# Altium schematic sheet BANK_3.SchDoc
size A4
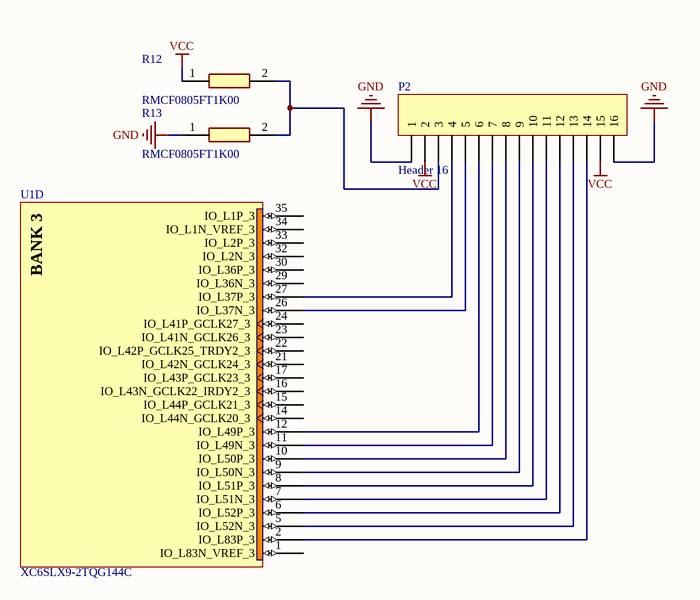
[diagram p0: BANK_3.SchDoc]

## Parts
P2  Header 16  [HDR1X16]
R12  RMCF0805FT1K00  [RESC2012X65N]
R13  RMCF0805FT1K00  [RESC2012X65N]
U1  XC6SLX9-2TQG144C  [TQG144_N]  (part D of 7)

## Nets
GND: P2.1 P2.16 R13.1
VCC: P2.2 P2.15 R12.1
NetP2_3: P2.3 R12.2 R13.2
NetP2_4: P2.4 U1.27(IO_L37P_3)
NetP2_5: P2.5 U1.26(IO_L37N_3)
NetP2_6: P2.6 U1.12(IO_L49P_3)
NetP2_7: P2.7 U1.11(IO_L49N_3)
NetP2_8: P2.8 U1.10(IO_L50P_3)
NetP2_9: P2.9 U1.9(IO_L50N_3)
NetP2_10: P2.10 U1.8(IO_L51P_3)
NetP2_11: P2.11 U1.7(IO_L51N_3)
NetP2_12: P2.12 U1.6(IO_L52P_3)
NetP2_13: P2.13 U1.5(IO_L52N_3)
NetP2_14: P2.14 U1.2(IO_L83P_3)

Not connected (* = marked no-connect by the designer): U1 1(IO_L83N_VREF_3) 14(IO_L44N_GCLK20_3) 15(IO_L44P_GCLK21_3) 16(IO_L43N_GCLK22_IRDY2_3) 17(IO_L43P_GCLK23_3) 21(IO_L42N_GCLK24_3) 22(IO_L42P_GCLK25_TRDY2_3) 23(IO_L41N_GCLK26_3) 24(IO_L41P_GCLK27_3) 29(IO_L36N_3) 30(IO_L36P_3) 32(IO_L2N_3) 33(IO_L2P_3) 34(IO_L1N_VREF_3) 35(IO_L1P_3)

## Notes on the sheet
- (in symbol XC6SLX9-2TQG144C, part D) BANK 3

## Library data of the parts
P2 = Header 16: Header, 16-Pin; LatestRevisionDate: 17-Jul-2002; LatestRevisionNote: Re-released for DXP Platform.; Publisher: Altium Limited
R12 R13 = RES 1K OHM 1% 1/8W 0805: Resistor; MF: Stackpole Electronics Inc; Price: None; Package: 2012 Stackpole; SnapEDA_Link: https://www.snapeda.com/parts/RMCF0805FT1K00/Stackpole%20Electronics%20Inc/view-part/3228308/?ref=snap; MP: RMCF0805FT1K00; Availability: Unavailable; Value: *
U1 = XC6SLX9-2TQG144C: Spartan-6 LX 1.2V FPGA, 102 User I/Os, 144-Pin TQFP (0.5mm Pitch), Speed Grade 2, Commercial Grade, Pb-Free; DatasheetVersion: ver1.6, Nov-2010; PackageVersion: ver1.2, Jun-2004; PackageReference: TQG144; PackageDescription: 144-Pin Thin Quad Flat Pack (TQG144) - Pb-Free; Code_JEDEC: MS-026-BFB; ComponentLink1Description: Manufacturer URL; ComponentLink1URL: http://www.xilinx.com/; ComponentLink2Description: Spartan-6 Datasheet; ComponentLink2URL: http://www.xilinx.com/support/documentation/data_sheets/ds160.pdf; ComponentLink3Description: Spartan-6 Documents; ComponentLink3URL: http://www.xilinx.com/support/documentation/spartan-6.htm